# EAGLE design hcgs-midi-mud-motherboard (EAGLE 9.2.2)
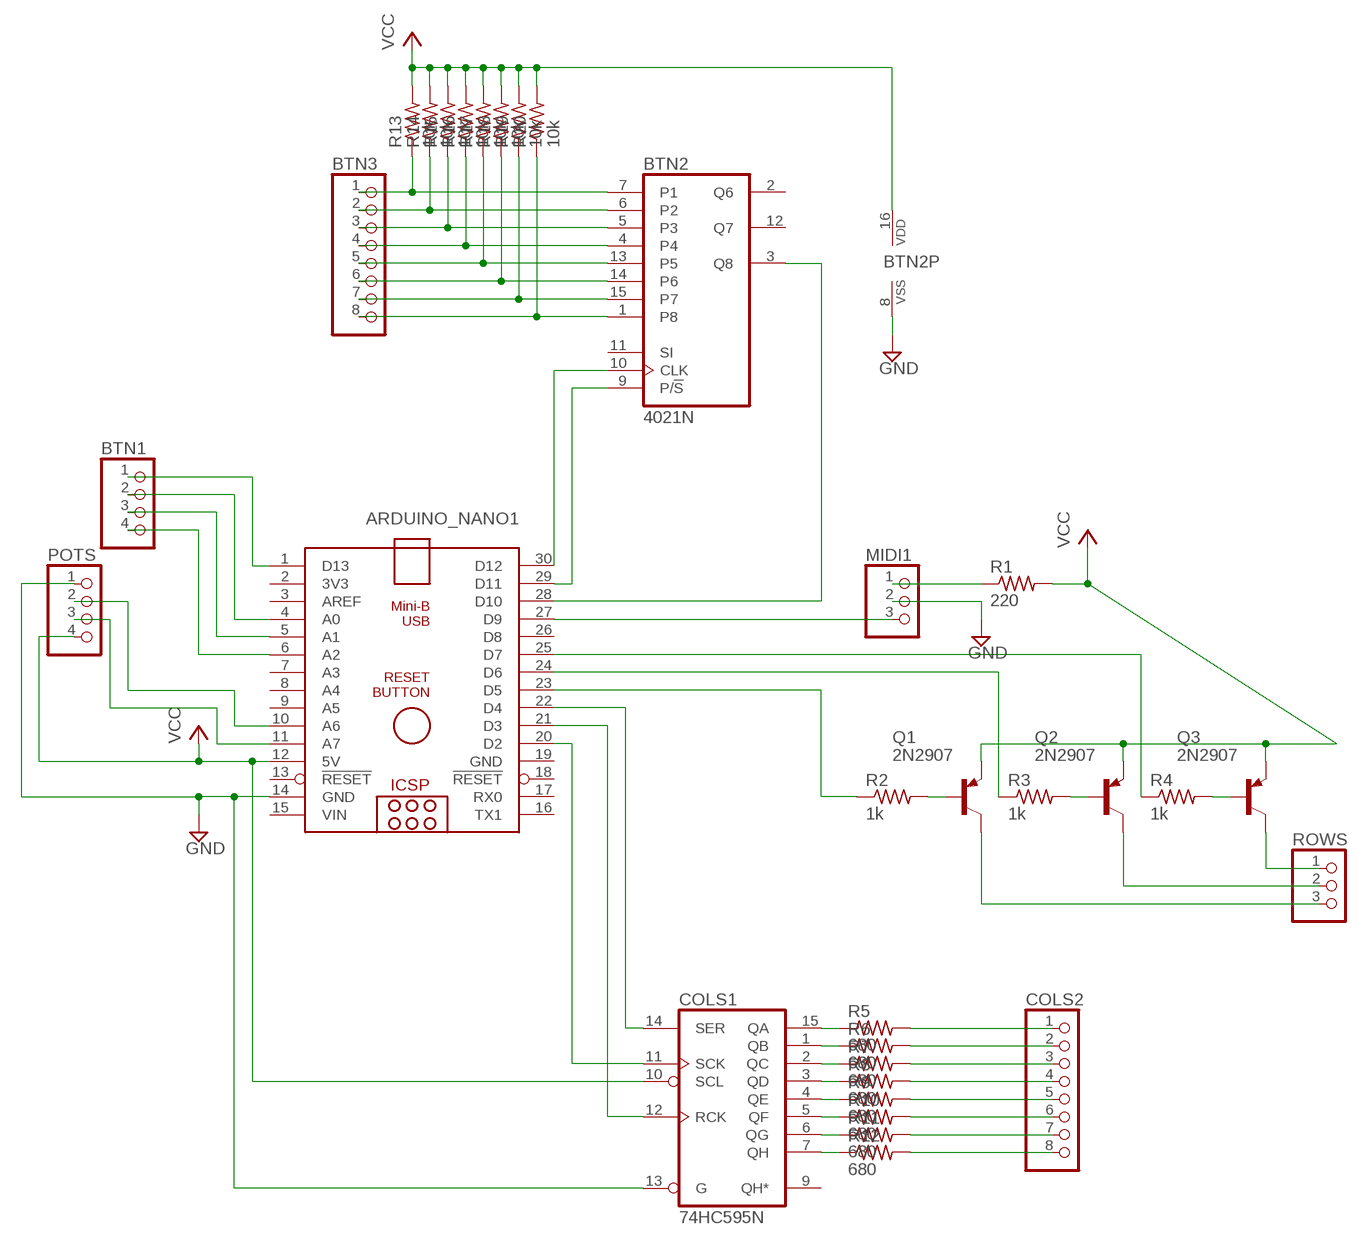
[diagram p0: schematic, sheet 1]

## Parts
ARDUINO_NANO1  ARDUINO_NANO_HCARDUINO_NANO_NO_HOLE  [ARDUINO_NANO_NO_HOLE]
BTN1  PINHD-1X4  [1X04]
BTN2  4021N  [DIL16]
BTN3  PINHD-1X8  [1X08]
COLS1  74HC595N  [DIL16]
COLS2  PINHD-1X8  [1X08]
MIDI1  PINHD-1X3  [1X03]
POTS  PINHD-1X4  [1X04]
Q1  2N2907  [TO92-EBC-OVAL]
Q2  2N2907  [TO92-EBC-OVAL]
Q3  2N2907  [TO92-EBC-OVAL]
R1  220  R-US_0309/12  [0309/12]
R2  1k  R-US_0309/12  [0309/12]
R3  1k  R-US_0309/12  [0309/12]
R4  1k  R-US_0309/12  [0309/12]
R5  680  R-US_0309/12  [0309/12]
R6  680  R-US_0309/12  [0309/12]
R7  680  R-US_0309/12  [0309/12]
R8  680  R-US_0309/12  [0309/12]
R9  680  R-US_0309/12  [0309/12]
R10  680  R-US_0309/12  [0309/12]
R11  680  R-US_0309/12  [0309/12]
R12  680  R-US_0309/12  [0309/12]
R13  10k  R-US_0309/12  [0309/12]
R14  10k  R-US_0309/12  [0309/12]
R15  10k  R-US_0309/12  [0309/12]
R16  10k  R-US_0309/12  [0309/12]
R17  10k  R-US_0309/12  [0309/12]
R18  10k  R-US_0309/12  [0309/12]
R19  10k  R-US_0309/12  [0309/12]
R20  10k  R-US_0309/12  [0309/12]
ROWS  PINHD-1X3  [1X03]

## Nets
GND: ARDUINO_NANO1.14(GND) BTN2.8(VSS) COLS1.13(G) MIDI1.2 POTS.1
N$1: ARDUINO_NANO1.1(D13) BTN1.1
N$2: ARDUINO_NANO1.4(A0) BTN1.2
N$3: ARDUINO_NANO1.11(A7) POTS.3
N$4: ARDUINO_NANO1.10(A6) POTS.2
N$5: ARDUINO_NANO1.5(A1) BTN1.3
N$6: ARDUINO_NANO1.6(A2) BTN1.4
N$7: Q1.B R2.2
N$8: MIDI1.1 R1.1
N$9: Q2.B R3.2
N$10: ARDUINO_NANO1.27(D9) MIDI1.3
N$11: Q3.B R4.2
N$12: ARDUINO_NANO1.23(D5) R2.1
N$13: ARDUINO_NANO1.24(D6) R3.1
N$14: ARDUINO_NANO1.25(D7) R4.1
N$15: Q1.C ROWS.3
N$16: Q2.C ROWS.2
N$17: Q3.C ROWS.1
N$18: COLS1.15(QA) R5.1
N$19: COLS1.1(QB) R6.1
N$20: COLS1.2(QC) R7.1
N$21: COLS1.3(QD) R8.1
N$22: COLS1.4(QE) R9.1
N$23: COLS1.5(QF) R10.1
N$24: COLS1.6(QG) R11.1
N$25: COLS1.7(QH) R12.1
N$26: COLS2.1 R5.2
N$27: COLS2.2 R6.2
N$28: COLS2.3 R7.2
N$29: COLS2.4 R8.2
N$30: COLS2.5 R9.2
N$31: COLS2.6 R10.2
N$32: COLS2.7 R11.2
N$33: COLS2.8 R12.2
N$34: ARDUINO_NANO1.20(D2) COLS1.11(SCK)
N$35: ARDUINO_NANO1.21(D3) COLS1.12(RCK)
N$36: BTN2.1(P8) BTN3.8 R20.1
N$37: ARDUINO_NANO1.22(D4) COLS1.14(SER)
N$38: BTN2.15(P7) BTN3.7 R19.1
N$39: BTN2.14(P6) BTN3.6 R18.1
N$40: BTN2.13(P5) BTN3.5 R17.1
N$41: BTN2.4 BTN3.4 R16.1
N$42: BTN2.5(P3) BTN3.3 R15.1
N$43: BTN2.6(P2) BTN3.2 R14.1
N$44: BTN2.7(P1) BTN3.1 R13.1
N$46: ARDUINO_NANO1.30(D12) BTN2.10(CLK)
N$47: ARDUINO_NANO1.28(D10) BTN2.3(Q8)
N$48: ARDUINO_NANO1.29(D11) BTN2.9(P/!S)
VCC: ARDUINO_NANO1.12(5V) BTN2.16(VDD) COLS1.10(SCL) POTS.4 Q1.E Q2.E Q3.E R1.2 R13.2 R14.2 R15.2 R16.2 R17.2 R18.2 R19.2 R20.2
Unconnected: ARDUINO_NANO1.2(3V3) ARDUINO_NANO1.3(AREF) ARDUINO_NANO1.7(A3) ARDUINO_NANO1.8(A4) ARDUINO_NANO1.9(A5) ARDUINO_NANO1.13(!RESET) ARDUINO_NANO1.16(TX1) ARDUINO_NANO1.17(RX0) ARDUINO_NANO1.18(!RESET) ARDUINO_NANO1.26(D8) BTN2.2(Q6) BTN2.11(SI) BTN2.12(Q7) COLS1.9(QH*)

## Power pins joined to a net without a drawn wire
GND: ARDUINO_NANO1.19(GND) COLS1.8(GND)
VCC: COLS1.16(VCC)
VIN: ARDUINO_NANO1.15(VIN)

## Library data of the parts
ARDUINO_NANO1 = ArduinoNano_HC:ARDUINO_NANO_HC: Arduino Nano HC Overview: The Arduino Nano is a small, complete, and breadboard-friendly board based on the ATmega328 (Arduino Nano 3.x) or ATmega168 (Arduino Nano 2.x). It has more or less the same functionality of the Arduino Duemilanove, but in a different package. It lacks only a DC power jack, and works with a Mini-B USB cable instead of a standard one. The Nano was designed and is being produced by Gravitech. Specifications: Microcontroller Atmel ATmega168 or ATmega328 Operating Voltage (logic level) 5 V Input Voltage (recommended) 7-12 V Input Voltage (limits) 6-20 V Digital I/O Pins 14 (of which 6 provide PWM output) Analog Input Pins 8 DC Current per I/O Pin 40 mA Flash Memory 16 KB (ATmega168) or 32 KB (ATmega328) of which 2 KB used by bootloader SRAM 1 KB (ATmega168) or 2 KB (ATmega328) EEPROM 512 bytes (ATmega168) or 1 KB (ATmega328) Clock Speed 16 MHz Dimensions 0.73" x 1.70" Length 45 mm Width 18 mm Weigth 5 g Power: The Arduino Nano can be powered via the Mini-B USB connection, 6-20V unregulated external power supply (pin 30), or 5V regulated external power supply (pin 27). The power source is automatically selected to the highest voltage source. Memory: The ATmega168 has 16 KB of flash memory for storing code (of which 2 KB is used for the bootloader); the ATmega328 has 32 KB, (also with 2 KB used for the bootloader). The ATmega168 has 1 KB of SRAM and 512 bytes of EEPROM (which can be read and written with the EEPROM library); the ATmega328 has 2 KB of SRAM and 1 KB of EEPROM. Input and Output: Each of the 14 digital pins on the Nano can be used as an input or output, using pinMode(), digitalWrite(), and digitalRead() functions. They operate at 5 volts. Each pin can provide or receive a maximum of 40 mA and has an internal pull-up resistor (disconnected by default) of 20-50 kOhms. In addition, some pins have specialized functions. Visit Arduino - ArduinoBoardNano <https://www.arduino.cc/en/Main/ArduinoBoardNano>
BTN1 POTS = pinhead:PINHD-1X4: PIN HEADER
BTN2 = 40xx:4021: 8-bit static SHIFT REGISTER
BTN3 COLS2 = pinhead:PINHD-1X8: PIN HEADER
COLS1 = 74xx-eu:74*595: 8-bit SHIFT REGISTER, output latch
MIDI1 ROWS = pinhead:PINHD-1X3: PIN HEADER
Q1-Q3 = adafruit:2N2907*: PNP Transistor Big Oval pads
R1-R20 = adafruit:R-US_: RESISTOR, American symbol

## Board
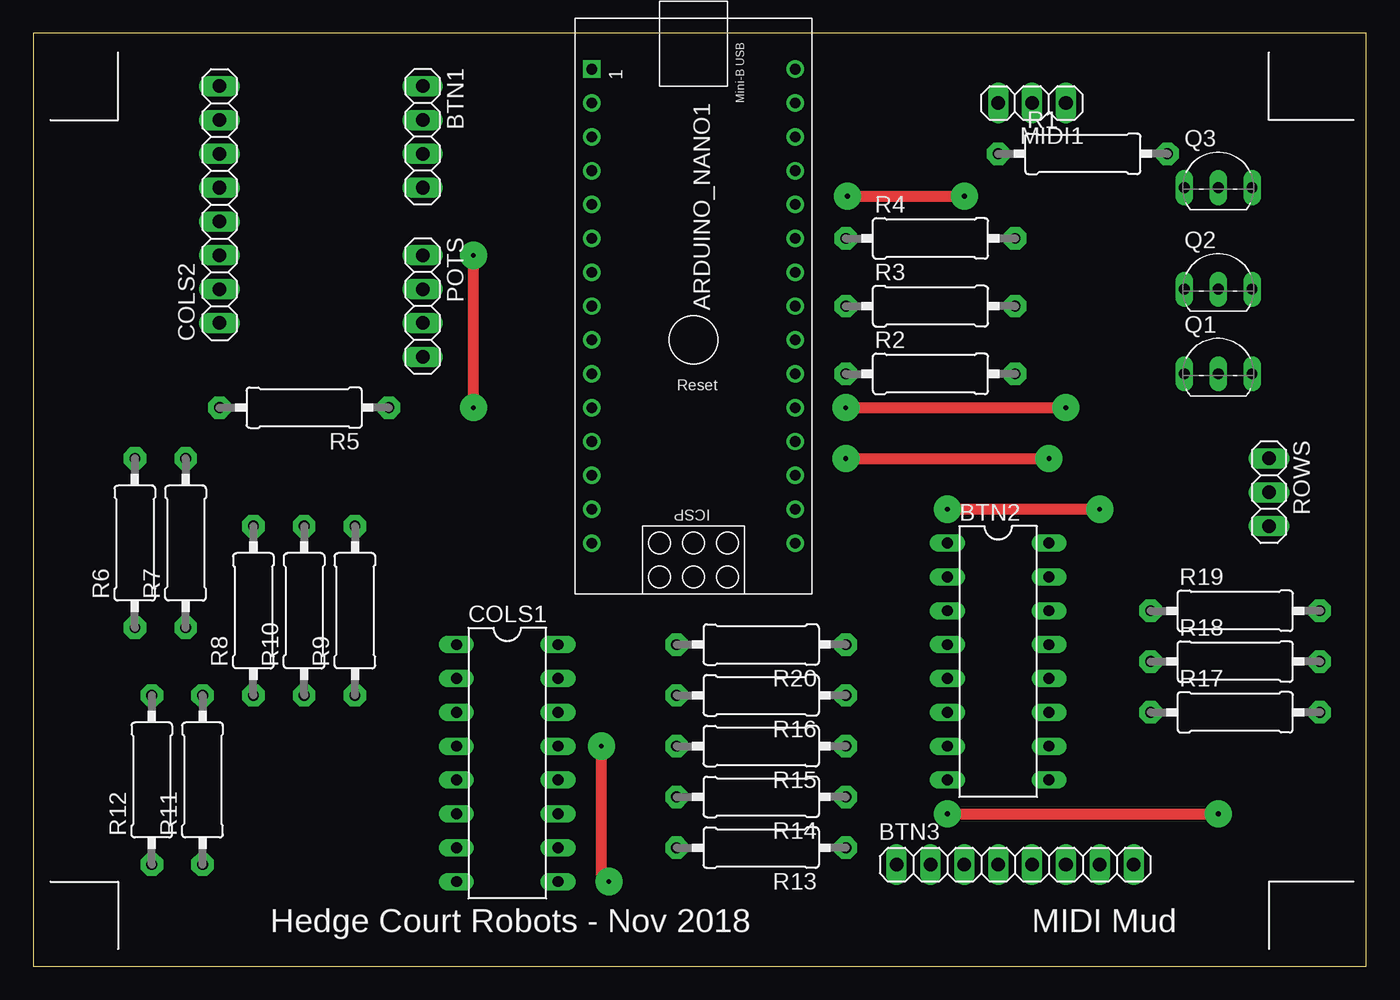
[diagram p1: board, top side]
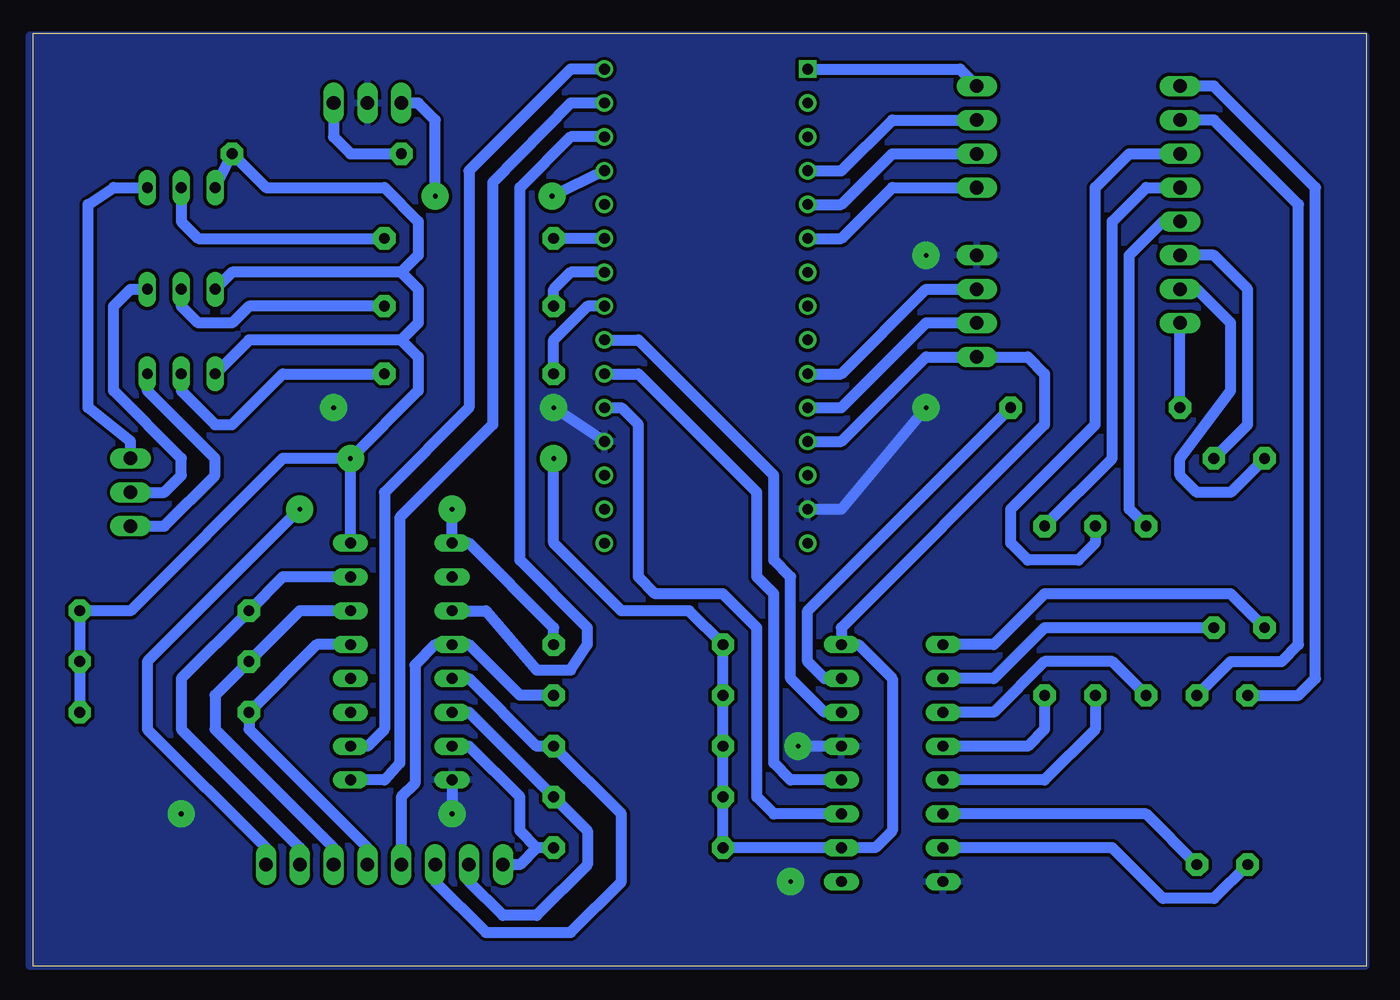
[diagram p2: board, bottom side, seen from below]

Size 100 x 70 mm. Coordinates in mm from the lower left corner, seen from the top.
Outline: 0,0 100,0 100,70 0,70 0,0
Copper layers (1*16): Top 0.035mm / dielectric 1.5mm / Bottom 0.035mm
Design rules "default *": minimum track width 6mil, minimum drill 0.35mm, track to track 10mil, track to pad 10mil, pad to pad 10mil, via to via 10mil, smd to smd 6mil, copper to edge 0mil, drill to drill 10mil, minimum pad ring 10mil, minimum via ring 8mil, stop-mask expansion 4mil, vias tented up to drill 0mil, thermal gap 10mil

### Footprints (pad centres in the part's own frame; a part is rotated, then mirrored left to right if it is on the bottom)
ARDUINO_NANO_NO_HOLE = drill 0.8 square: 1 -20.32,-7.62 | drill 0.8: 2 -17.78,-7.62; 3 -15.24,-7.62; 4 -12.7,-7.62; 5 -10.16,-7.62; 6 -7.62,-7.62; 7 -5.08,-7.62; 8 -2.54,-7.62; 9 0,-7.62; 10 2.54,-7.62; 11 5.08,-7.62; 12 7.62,-7.62; 13 10.16,-7.62; 14 12.7,-7.62; 15 15.24,-7.62; 16 15.24,7.62; 17 12.7,7.62; 18 10.16,7.62; 19 7.62,7.62; 20 5.08,7.62; 21 2.54,7.62; 22 0,7.62; 23 -2.54,7.62; 24 -5.08,7.62; 25 -7.62,7.62; 26 -10.16,7.62; 27 -12.7,7.62; 28 -15.24,7.62; 29 -17.78,7.62; 30 -20.32,7.62
1X04 = drill 1.016 long: 1 -3.81,0; 2 -1.27,0; 3 1.27,0; 4 3.81,0
DIL16 = drill 0.813 long: 1 -8.89,-3.81; 2 -6.35,-3.81; 3 -3.81,-3.81; 4 -1.27,-3.81; 5 1.27,-3.81; 6 3.81,-3.81; 7 6.35,-3.81; 8 8.89,-3.81; 9 8.89,3.81; 10 6.35,3.81; 11 3.81,3.81; 12 1.27,3.81; 13 -1.27,3.81; 14 -3.81,3.81; 15 -6.35,3.81; 16 -8.89,3.81
1X08 = drill 1.016 long: 1 -8.89,0; 2 -6.35,0; 3 -3.81,0; 4 -1.27,0; 5 1.27,0; 6 3.81,0; 7 6.35,0; 8 8.89,0
1X03 = drill 1.016 long: 1 -2.54,0; 2 0,0; 3 2.54,0
TO92-EBC-OVAL = drill 0.813 long: B 0,-1.27; C 2.54,-1.27; E -2.54,-1.27
0309/12 = drill 0.813 pad 1.676 octagon: 1 -6.35,0; 2 6.35,0

### Placement (x,y rotation side)
ARDUINO_NANO1  49.53,46.99 270 top
BTN1  29.21,62.23 270 top
BTN2  72.39,22.86 270 top
BTN3  73.66,7.62 0 top
COLS1  35.56,15.24 270 top
COLS2  13.97,57.15 90 top
MIDI1  74.93,64.77 180 top
POTS  29.21,49.53 270 top
Q1  88.9,45.72 0 top
Q2  88.9,52.07 0 top
Q3  88.9,59.69 0 top
R1  78.74,60.96 0 top
R2  67.31,44.45 0 top
R3  67.31,49.53 0 top
R4  67.31,54.61 0 top
R5  20.32,41.91 180 top
R6  7.62,31.75 90 top
R7  11.43,31.75 90 top
R8  16.51,26.67 90 top
R9  24.13,26.67 90 top
R10  20.32,26.67 90 top
R11  12.7,13.97 90 top
R12  8.89,13.97 90 top
R13  54.61,8.89 180 top
R14  54.61,12.7 180 top
R15  54.61,16.51 180 top
R16  54.61,20.32 180 top
R17  90.17,19.05 0 top
R18  90.17,22.86 0 top
R19  90.17,26.67 0 top
R20  54.61,24.13 180 top
ROWS  92.71,35.56 270 top

### Tracks (layer width: path | path; a pad name or v marks a point on that pad's centre or on a via)
GND  (via drill 0.35 pad 2.03)
  Top 0.813: v68.58,11.43 v88.9,11.43 | v60.96,41.91 v77.47,41.91 | v33.02,41.91 v33.02,53.34 | v43.18,6.35 42.62,6.91 v42.62,16.51
  Bottom 0.813: BTN2.8 v68.58,11.43 | COLS1.13 v42.62,16.51 | ARDUINO_NANO1.19 v60.96,41.91 | ARDUINO_NANO1.14 39.37,34.29 v33.02,41.91
  pour Bottom: 0,0 0,69.85 100.33,69.85 100.33,0
N$1
  Bottom 0.813: BTN1.1 30.48,67.31 ARDUINO_NANO1.1
N$2
  Bottom 0.813: BTN1.2 35.56,63.5 39.37,59.69 ARDUINO_NANO1.4
N$3
  Bottom 0.813: POTS.3 33.02,48.26 39.37,41.91 ARDUINO_NANO1.11
N$4
  Bottom 0.813: POTS.2 33.02,50.8 39.37,44.45 ARDUINO_NANO1.10
N$5
  Bottom 0.813: BTN1.3 35.56,60.96 39.37,57.15 ARDUINO_NANO1.5
N$6
  Bottom 0.813: BTN1.4 35.56,58.42 39.37,54.61 ARDUINO_NANO1.6
N$7
  Bottom 0.813: Q1.B 88.9,43.18 86.36,40.64 85.09,40.64 81.28,44.45 R2.2
N$8
  Bottom 0.813: MIDI1.1 77.47,62.23 76.2,60.96 R1.1
N$9
  Bottom 0.813: R3.2 83.82,49.53 85.09,48.26 87.63,48.26 88.9,49.53 Q2.B
N$10  (via drill 0.35 pad 2.03)
  Top 0.813: v61.09,57.78 v69.85,57.78
  Bottom 0.813: v69.85,57.78 69.85,63.5 71.12,64.77 MIDI1.3 | ARDUINO_NANO1.27 v61.09,57.78
N$11
  Bottom 0.813: Q3.B 88.9,55.88 87.63,54.61 R4.2
N$12
  Bottom 0.813: R2.1 60.96,46.99 58.42,49.53 ARDUINO_NANO1.23
N$13
  Bottom 0.813: R3.1 60.96,50.8 59.69,52.07 ARDUINO_NANO1.24
N$14
  Bottom 0.813: ARDUINO_NANO1.25 R4.1
N$15
  Bottom 0.813: ROWS.3 90.17,33.02 86.36,36.83 86.36,38.1 91.44,43.18 Q1.C
N$16
  Bottom 0.813: Q2.C 92.71,50.8 93.98,49.53 93.98,43.18 88.9,38.1 88.9,36.83 90.17,35.56 ROWS.2
N$17
  Bottom 0.813: Q3.C 93.98,58.42 95.89,57.15 95.89,41.91 92.71,39.37 ROWS.1
N$18
  Bottom 0.813: COLS1.15 40.64,21.59 41.91,22.86 41.91,26.67 R5.1
N$19
  Bottom 0.813: R6.1 10.16,27.94 24.13,27.94 27.94,24.13 COLS1.1
N$20
  Bottom 0.813: COLS1.2 27.94,21.59 24.13,25.4 R7.1
N$21
  Bottom 0.813: R8.1 19.05,22.86 24.13,22.86 27.94,19.05 COLS1.3
N$22
  Bottom 0.813: R9.1 24.13,17.78 25.4,16.51 COLS1.4
N$23
  Bottom 0.813: R10.1 20.32,17.78 24.13,13.97 COLS1.5
N$24
  Bottom 0.813: R11.1 16.51,11.43 COLS1.6
N$25
  Bottom 0.813: R12.1 11.43,5.08 15.24,5.08 19.05,8.89 COLS1.7
N$26
  Bottom 0.813: R5.2 COLS2.1
N$27
  Bottom 0.813: R6.2 10.16,35.56 12.7,35.56 13.97,36.83 13.97,38.1 10.16,43.18 10.16,48.26 12.7,50.8 COLS2.2
N$28
  Bottom 0.813: R7.2 8.89,40.64 8.89,50.8 11.43,53.34 COLS2.3
N$29
  Bottom 0.508: 15.24,55.88 COLS2.4
  Bottom 0.813: R8.2 17.78,34.29 17.78,53.34 15.24,55.88
N$30
  Bottom 0.813: R9.2 19.05,38.1 19.05,55.88 16.51,58.42 COLS2.5
N$31
  Bottom 0.813: COLS2.6 17.78,60.96 20.32,58.42 20.32,40.64 26.67,34.29 26.67,31.75 25.4,30.48 21.59,30.48 20.32,31.75 R10.2
N$32
  Bottom 0.813: R11.2 10.16,22.86 6.35,22.86 5.08,24.13 5.08,57.15 11.43,63.5 COLS2.7
N$33
  Bottom 0.813: R12.2 5.08,20.32 3.81,21.59 3.81,58.42 11.43,66.04 COLS2.8
N$34
  Bottom 0.813: COLS1.11 44.45,11.43 45.72,12.7 45.72,25.4 48.26,27.94 53.34,27.94 54.61,29.21 54.61,40.64 55.88,41.91 ARDUINO_NANO1.20
N$35
  Bottom 0.813: COLS1.12 43.18,13.97 44.45,15.24 44.45,27.94 45.72,29.21 45.72,35.56 54.61,44.45 ARDUINO_NANO1.21
N$36  (via drill 0.35 pad 2.03)
  Top 0.813: v68.58,34.29 v80.01,34.29
  Bottom 0.813: v68.58,34.29 BTN2.1 67.31,31.75 60.96,25.4 R20.1 | v80.01,34.29 91.44,22.86 91.44,17.78 82.55,8.89 BTN3.8
N$37
  Bottom 0.813: COLS1.14 40.64,19.05 43.18,21.59 43.18,29.21 44.45,30.48 44.45,36.83 54.61,46.99 ARDUINO_NANO1.22
N$38
  Bottom 0.813: BTN3.7 80.01,8.89 88.9,17.78 88.9,21.59 R19.1 81.28,29.21 BTN2.15
N$39
  Bottom 0.813: BTN3.6 77.47,8.89 86.36,17.78 86.36,20.32 R18.1 80.01,26.67 BTN2.14
N$40
  Bottom 0.508: 74.93,8.89 BTN3.5
  Bottom 0.813: 74.93,8.89 83.82,17.78 R17.1 78.74,24.13 BTN2.13
N$41
  Bottom 0.813: BTN3.4 72.39,12.7 71.37,13.72 71.37,22.61 69.85,24.13 BTN2.4 67.31,24.13 63.5,20.32 R16.1
N$42
  Bottom 0.813: BTN2.5 67.31,21.59 62.23,16.51 R15.1 55.88,11.43 55.88,6.35 59.69,2.54 66.04,2.54 69.85,6.35 BTN3.3
N$43
  Bottom 0.813: BTN2.6 67.31,19.05 R14.1 58.42,10.16 58.42,7.62 62.23,3.81 64.77,3.81 67.31,6.35 BTN3.2
N$44
  Bottom 0.813: R13.1 62.23,8.89 | 62.23,8.89 63.5,7.62 BTN3.1 | 62.23,8.89 63.5,10.16 63.5,12.7 67.31,16.51 BTN2.7
N$46
  Bottom 0.813: BTN2.10 74.93,16.51 73.66,17.78 73.66,35.56 67.31,41.91 67.31,59.69 59.69,67.31 ARDUINO_NANO1.30
N$47
  Bottom 0.813: BTN2.3 66.04,26.67 62.23,22.23 59.69,22.23 58.42,24.13 58.42,25.4 63.5,30.48 63.5,58.42 59.69,62.23 ARDUINO_NANO1.28
N$48
  Bottom 0.813: BTN2.9 73.66,13.97 72.52,15.24 72.52,33.66 65.53,40.64 65.53,58.8 59.69,64.77 ARDUINO_NANO1.29
VCC  (via drill 0.35 pad 2.03)
  Top 0.813: v60.96,38.1 v76.2,38.1
  Bottom 0.813: 72.39,52.07 71.12,53.34 71.12,55.88 73.66,58.42 82.55,58.42 R1.2 Q3.E | 72.39,52.07 85.09,52.07 Q2.E | 72.39,52.07 71.12,50.8 71.12,48.26 72.39,46.99 | 72.39,46.99 83.82,46.99 Q1.E | 72.39,46.99 71.12,45.72 71.12,43.18 v76.2,38.1 | v76.2,38.1 81.28,38.1 92.71,26.67 R19.2 R18.2 R17.2 | BTN2.16 v76.2,38.1 | v60.96,38.1 60.96,31.75 55.88,26.67 50.8,26.67 R20.2 R16.2 R15.2 R14.2 R13.2 COLS1.10 36.83,8.89 35.56,10.16 35.56,21.59 38.1,24.13 COLS1.16 39.37,25.4 24.13,40.64 24.13,44.45 25.4,45.72 POTS.4 33.02,45.72 39.37,39.37 ARDUINO_NANO1.12

### Text on the board
tPlace: Hedge Court Robots - Nov 2018 | MIDI Mud